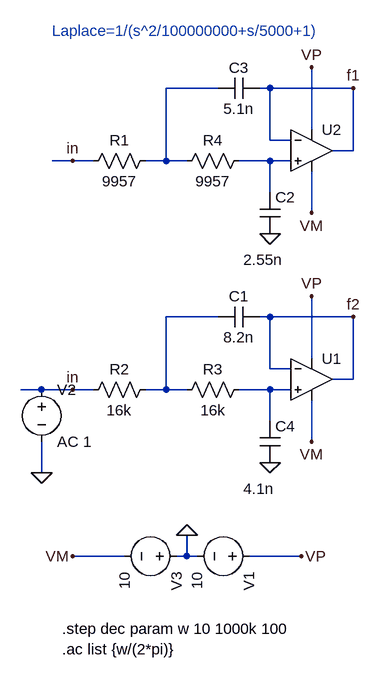
[diagram p0: schematic butterworth_2.asc]
butterworth_2.asc, the LTspice schematic file:
Version 4
SHEET 1 880 680
WIRE -32 -288 -112 -288
WIRE 48 -288 32 -288
WIRE 176 -288 48 -288
WIRE 112 -224 112 -320
WIRE 48 -208 48 -288
WIRE 80 -208 48 -208
WIRE 176 -192 176 -288
WIRE 176 -192 144 -192
WIRE -256 -176 -288 -176
WIRE -224 -176 -256 -176
WIRE -112 -176 -112 -288
WIRE -112 -176 -144 -176
WIRE -80 -176 -112 -176
WIRE 48 -176 0 -176
WIRE 80 -176 48 -176
WIRE 48 -128 48 -176
WIRE 112 -96 112 -160
WIRE -32 64 -112 64
WIRE 48 64 32 64
WIRE 176 64 48 64
WIRE 112 128 112 32
WIRE 48 144 48 64
WIRE 80 144 48 144
WIRE 176 160 176 64
WIRE 176 160 144 160
WIRE -304 176 -336 176
WIRE -256 176 -304 176
WIRE -224 176 -256 176
WIRE -112 176 -112 64
WIRE -112 176 -144 176
WIRE -80 176 -112 176
WIRE 48 176 0 176
WIRE 80 176 48 176
WIRE 48 224 48 176
WIRE 112 256 112 192
WIRE -304 304 -304 256
WIRE -176 432 -256 432
WIRE -80 432 -80 400
WIRE -80 432 -96 432
WIRE -64 432 -80 432
WIRE 96 432 16 432
FLAG -304 304 0
FLAG -80 400 0
FLAG 48 288 0
FLAG 96 432 VP
FLAG -256 432 VM
FLAG 112 32 VP
FLAG 112 256 VM
FLAG 48 -64 0
FLAG 112 -320 VP
FLAG 112 -96 VM
FLAG -256 -176 in
FLAG -256 176 in
FLAG 176 -288 f1
FLAG 176 64 f2
SYMBOL Opamps\\UniversalOpamp2 112 160 R0
SYMATTR InstName U1
SYMATTR SpiceModel level.1
SYMBOL voltage 32 432 R90
WINDOW 123 0 0 Left 0
WINDOW 39 0 0 Left 0
SYMATTR InstName V1
SYMATTR Value 10
SYMBOL voltage -304 160 R0
WINDOW 123 0 0 Left 0
WINDOW 39 0 0 Left 0
SYMATTR InstName V2
SYMATTR Value AC 1
SYMBOL voltage -80 432 R90
WINDOW 123 0 0 Left 0
WINDOW 39 0 0 Left 0
SYMATTR InstName V3
SYMATTR Value 10
SYMBOL res -128 160 R90
WINDOW 0 0 56 VBottom 0
WINDOW 3 32 56 VTop 0
SYMATTR InstName R2
SYMATTR Value 16k
SYMBOL res 16 160 R90
WINDOW 0 0 56 VBottom 0
WINDOW 3 32 56 VTop 0
SYMATTR InstName R3
SYMATTR Value 16k
SYMBOL cap 32 224 R0
WINDOW 3 -25 104 Left 0
SYMATTR Value 4.1n
SYMATTR InstName C4
SYMBOL cap 32 48 R90
WINDOW 0 0 32 VBottom 0
WINDOW 3 32 32 VTop 0
SYMATTR InstName C1
SYMATTR Value 8.2n
SYMBOL Opamps\\UniversalOpamp2 112 -192 R0
SYMATTR InstName U2
SYMATTR SpiceModel level.1
SYMBOL res -128 -192 R90
WINDOW 0 0 56 VBottom 0
WINDOW 3 32 56 VTop 0
SYMATTR InstName R1
SYMATTR Value 9957
SYMBOL res 16 -192 R90
WINDOW 0 0 56 VBottom 0
WINDOW 3 32 56 VTop 0
SYMATTR InstName R4
SYMATTR Value 9957
SYMBOL cap 32 -128 R0
WINDOW 3 -25 104 Left 0
SYMATTR Value 2.55n
SYMATTR InstName C2
SYMBOL cap 32 -304 R90
WINDOW 0 0 32 VBottom 0
WINDOW 3 32 32 VTop 0
SYMATTR InstName C3
SYMATTR Value 5.1n
TEXT -272 544 Left 0 !.step dec param w 10 1000k 100\n.ac list {w/(2*pi)}
TEXT -288 -376 Left 0 ;Laplace=1/(s^2/100000000+s/5000+1)

The netlist it stands for:
* butterworth_2.asc
XU1 N004 f2 VP VM f2 level.1 Avol=1Meg GBW=10Meg Slew=10Meg ilimit=25m rail=0 Vos=0 phimargin=45 en=0 enk=0 in=0 ink=0 Rin=500Meg  ; pins IN+ IN- V+ V- OUT
V1 VP 0 10
V2 in 0 AC 1
V3 0 VM 10
R2 N003 in 16k
R3 N004 N003 16k
C4 N004 0 4.1n
C1 f2 N003 8.2n
XU2 N002 f1 VP VM f1 level.1 Avol=1Meg GBW=10Meg Slew=10Meg ilimit=25m rail=0 Vos=0 phimargin=45 en=0 enk=0 in=0 ink=0 Rin=500Meg  ; pins IN+ IN- V+ V- OUT
R1 N001 in 9957
R4 N002 N001 9957
C2 N002 0 2.55n
C3 f1 N001 5.1n
.step dec param w 10 1000k 100
.ac list {w/(2*pi)}
* Laplace=1/(s^2/100000000+s/5000+1)
.lib UniversalOpamps2.sub
.backanno
.end